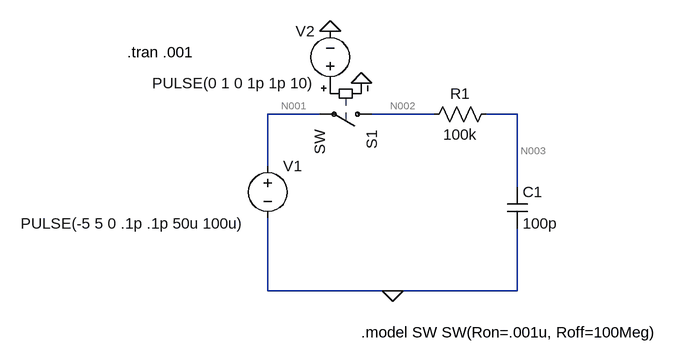
[diagram p0: schematic Circuit4.asc]
Circuit4.asc, the LTspice schematic file:
Version 4.1
SHEET 1 880 680
WIRE -16 64 -96 64
WIRE 160 64 64 64
WIRE 288 64 240 64
WIRE -96 144 -96 64
WIRE 288 176 288 64
WIRE -96 336 -96 224
WIRE 96 336 -96 336
WIRE 288 336 288 240
WIRE 288 336 96 336
FLAG 0 -64 0
FLAG 48 16 0
FLAG 96 336 0
SYMBOL voltage -96 128 R0
WINDOW 3 -380 104 Left 2
WINDOW 123 0 0 Left 0
WINDOW 39 0 0 Left 0
SYMATTR Value PULSE(-5 5 0 .1p .1p 50u 100u)
SYMATTR InstName V1
SYMBOL sw 80 64 R90
SYMATTR InstName S1
SYMBOL res 256 48 R90
WINDOW 0 0 56 VBottom 2
WINDOW 3 32 56 VTop 2
SYMATTR InstName R1
SYMATTR Value 100k
SYMBOL cap 272 176 R0
SYMATTR InstName C1
SYMATTR Value 100p
SYMBOL voltage 0 32 R180
WINDOW 0 24 96 Left 2
WINDOW 3 24 16 Left 2
WINDOW 123 0 0 Left 0
WINDOW 39 0 0 Left 0
SYMATTR InstName V2
SYMATTR Value PULSE(0 1 0 1p 1p 10)
TEXT 48 400 Left 2 !.model SW SW(Ron=.001u, Roff=100Meg)
TEXT -312 -32 Left 2 !.tran .001

The netlist it stands for:
* Circuit4.asc
V1 N001 0 PULSE(-5 5 0 .1p .1p 50u 100u)
S1 N002 N001 P001 0 SW
R1 N003 N002 100k
C1 N003 0 100p
V2 P001 0 PULSE(0 1 0 1p 1p 10)
.model SW SW(Ron=.001u, Roff=100Meg)
.tran .001
.backanno
.end

* Results of the author's LTspice run, read from the files saved beside the schematic
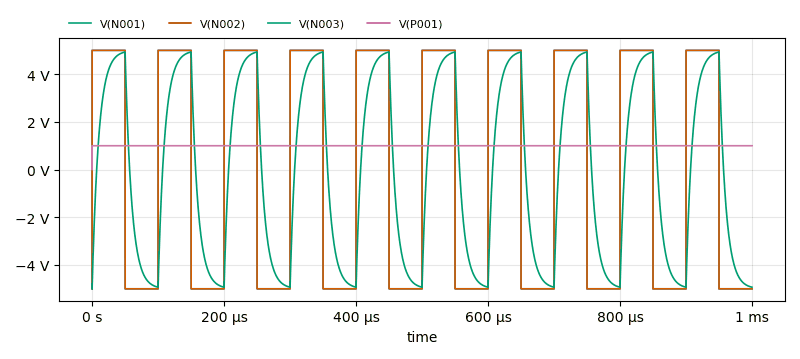
[diagram p1: Transient Analysis of Circuit4.asc, plotted from the saved traces]
* Transient Analysis, 1 run:
*   V(N001): min -5 V, max 5 V, average 0 V, rms 5 V, last -5 V
*   V(N002): min -5 V, max 5 V, average 0 V, rms 5 V, last -5 V
*   V(N003): min -5 V, max 4.933 V, average -666.9 µV, rms 3.893 V, last -4.933 V
*   V(P001): min 0 V, max 1 V, average 1 V, rms 1 V, last 1 V